# Altium schematic sheet voltage_input.schdoc
size A4
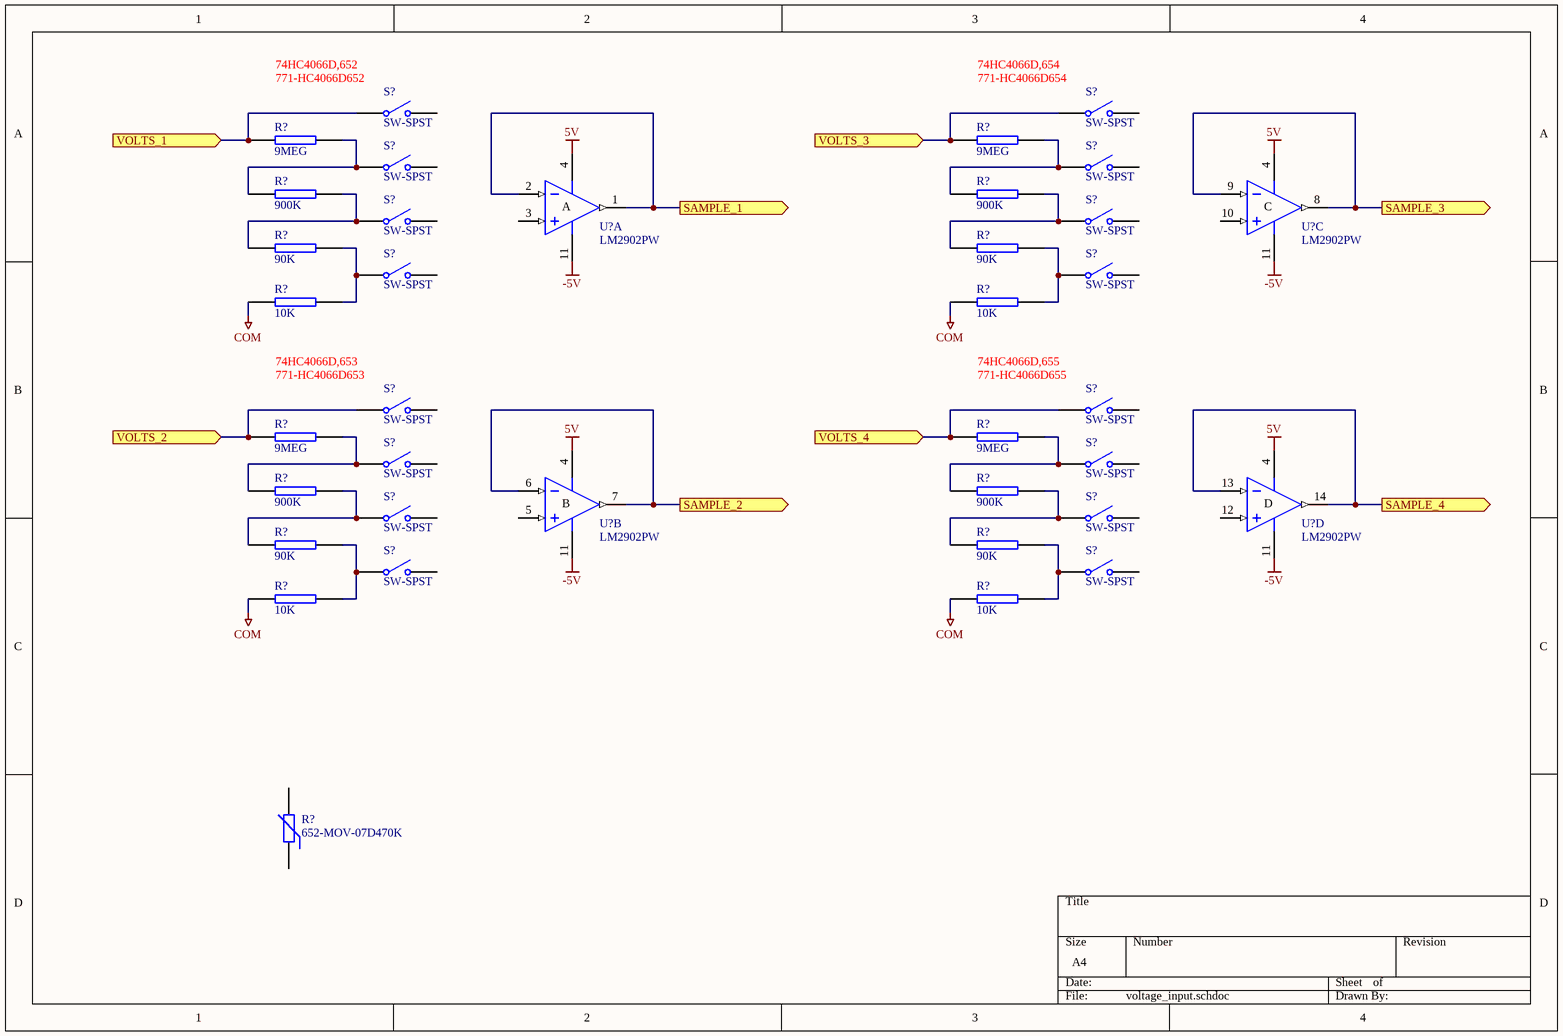
[diagram p0: voltage_input.schdoc]

## Parts
(Parts that share a designator on the sheet are numbered #1, #2 ... from top to bottom, then left to right.)
R?#1  9MEG  [RES(3D) - 0603]
R?#2  9MEG  [RES(3D) - 0603]
R?#3  900K  [RES(3D) - 0603]
R?#4  900K  [RES(3D) - 0603]
R?#5  90K  [RES(3D) - 0603]
R?#6  90K  [RES(3D) - 0603]
R?#7  10K  [RES(3D) - 0603]
R?#8  10K  [RES(3D) - 0603]
R?#9  9MEG  [RES(3D) - 0603]
R?#10  9MEG  [RES(3D) - 0603]
R?#11  900K  [RES(3D) - 0603]
R?#12  900K  [RES(3D) - 0603]
R?#13  90K  [RES(3D) - 0603]
R?#14  90K  [RES(3D) - 0603]
R?#15  10K  [RES(3D) - 0603]
R?#16  10K  [RES(3D) - 0603]
R?#17  652-MOV-07D470K  [6-0805_N]
S?#1  SW-SPST  [SPST-2]
S?#2  SW-SPST  [SPST-2]
S?#3  SW-SPST  [SPST-2]
S?#4  SW-SPST  [SPST-2]
S?#5  SW-SPST  [SPST-2]
S?#6  SW-SPST  [SPST-2]
S?#7  SW-SPST  [SPST-2]
S?#8  SW-SPST  [SPST-2]
S?#9  SW-SPST  [SPST-2]
S?#10  SW-SPST  [SPST-2]
S?#11  SW-SPST  [SPST-2]
S?#12  SW-SPST  [SPST-2]
S?#13  SW-SPST  [SPST-2]
S?#14  SW-SPST  [SPST-2]
S?#15  SW-SPST  [SPST-2]
S?#16  SW-SPST  [SPST-2]
U?#1  LM2902PW  [PW014_N]  (part A of 4)
U?#2  LM2902PW  [PW014_N]  (part C of 4)
U?#3  LM2902PW  [PW014_N]  (part B of 4)
U?#4  LM2902PW  [PW014_N]  (part D of 4)

## Ports
SAMPLE_1 (out), SAMPLE_2 (out), SAMPLE_3 (out), SAMPLE_4 (out), VOLTS_1 (in), VOLTS_2 (in), VOLTS_3 (in), VOLTS_4 (in)

## Nets
5V: U?#1.4(V+) U?#2.4(V+) U?#3.4(V+) U?#4.4(V+)
-5V: U?#1.11(V-) U?#2.11(V-) U?#3.11(V-) U?#4.11(V-)
COM: R?#7.2 R?#8.2 R?#15.2 R?#16.2
SAMPLE_1: U?#1.1(OUT) U?#1.2(IN-) ; port SAMPLE_1
SAMPLE_2: U?#3.6(IN-) U?#3.7(OUT) ; port SAMPLE_2
SAMPLE_3: U?#2.8(OUT) U?#2.9(IN-) ; port SAMPLE_3
SAMPLE_4: U?#4.13(IN-) U?#4.14(OUT) ; port SAMPLE_4
VOLTS_1: R?#1.2 S?#1.1(COMMON) ; port VOLTS_1
VOLTS_2: R?#9.2 S?#9.1(COMMON) ; port VOLTS_2
VOLTS_3: R?#2.2 S?#2.1(COMMON) ; port VOLTS_3
VOLTS_4: R?#10.2 S?#10.1(COMMON) ; port VOLTS_4
NetR?#1_1: R?#1.1 R?#3.2 S?#3.1(COMMON)
NetR?#2_1: R?#2.1 R?#4.2 S?#4.1(COMMON)
NetR?#3_1: R?#3.1 R?#5.2 S?#5.1(COMMON)
NetR?#4_1: R?#4.1 R?#6.2 S?#6.1(COMMON)
NetR?#5_1: R?#5.1 R?#7.1 S?#7.1(COMMON)
NetR?#6_1: R?#6.1 R?#8.1 S?#8.1(COMMON)
NetR?#9_1: R?#9.1 R?#11.2 S?#11.1(COMMON)
NetR?#10_1: R?#10.1 R?#12.2 S?#12.1(COMMON)
NetR?#11_1: R?#11.1 R?#13.2 S?#13.1(COMMON)
NetR?#12_1: R?#12.1 R?#14.2 S?#14.1(COMMON)
NetR?#13_1: R?#13.1 R?#15.1 S?#15.1(COMMON)
NetR?#14_1: R?#14.1 R?#16.1 S?#16.1(COMMON)

Not connected (* = marked no-connect by the designer): R?#17 1 2; S?#1 2(NO); S?#2 2(NO); S?#3 2(NO); S?#4 2(NO); S?#5 2(NO); S?#6 2(NO); S?#7 2(NO); S?#8 2(NO); S?#9 2(NO); S?#10 2(NO); S?#11 2(NO); S?#12 2(NO); S?#13 2(NO); S?#14 2(NO); S?#15 2(NO); S?#16 2(NO); U?#1 3(IN+); U?#2 10(IN+); U?#3 5(IN+); U?#4 12(IN+)

## Notes on the sheet
- 74HC4066D,652
- 771-HC4066D652
- 74HC4066D,654
- 771-HC4066D654
- 74HC4066D,653
- 771-HC4066D653
- 74HC4066D,655
- 771-HC4066D655
- (in symbol LM2902PW, part A) A
- (in symbol LM2902PW, part B) B
- (in symbol LM2902PW, part C) C
- (in symbol LM2902PW, part D) D

## Library data of the parts
R?#1-R?#16 = RES SMD 0603 10k: RESISTOR SMD 0603 10k; Manufacturer: Bourns; Manufacturer Part No.: CR0603FX-1002ELF; Mouser Part no.: 652-CR0603FX-1002ELF; Web link: http://au.mouser.com/Search/Refine.aspx?Keyword=652-CR0603FX-1002ELF
  R?#1 R?#2 R?#9 R?#10: value: 9MEG
  R?#3 R?#4 R?#11 R?#12: value: 900K
  R?#5 R?#6 R?#13 R?#14: value: 90K
  R?#7 R?#8 R?#15 R?#16: value: 10K
R?#17 = Res Varistor: Varistor (Voltage-Sensitive Resistor)
S?#1-S?#16 = SW-SPST: Single-Pole, Single-Throw Switch
U?#1-U?#4 = LM2902PW: Quadruple Operational Amplifier